# Altium schematic sheet [18] - POWER BLOCK DIAGRAM.SchDoc
size A3; DocumentNumber: 2; SheetNumber: 2; SheetTotal: 4
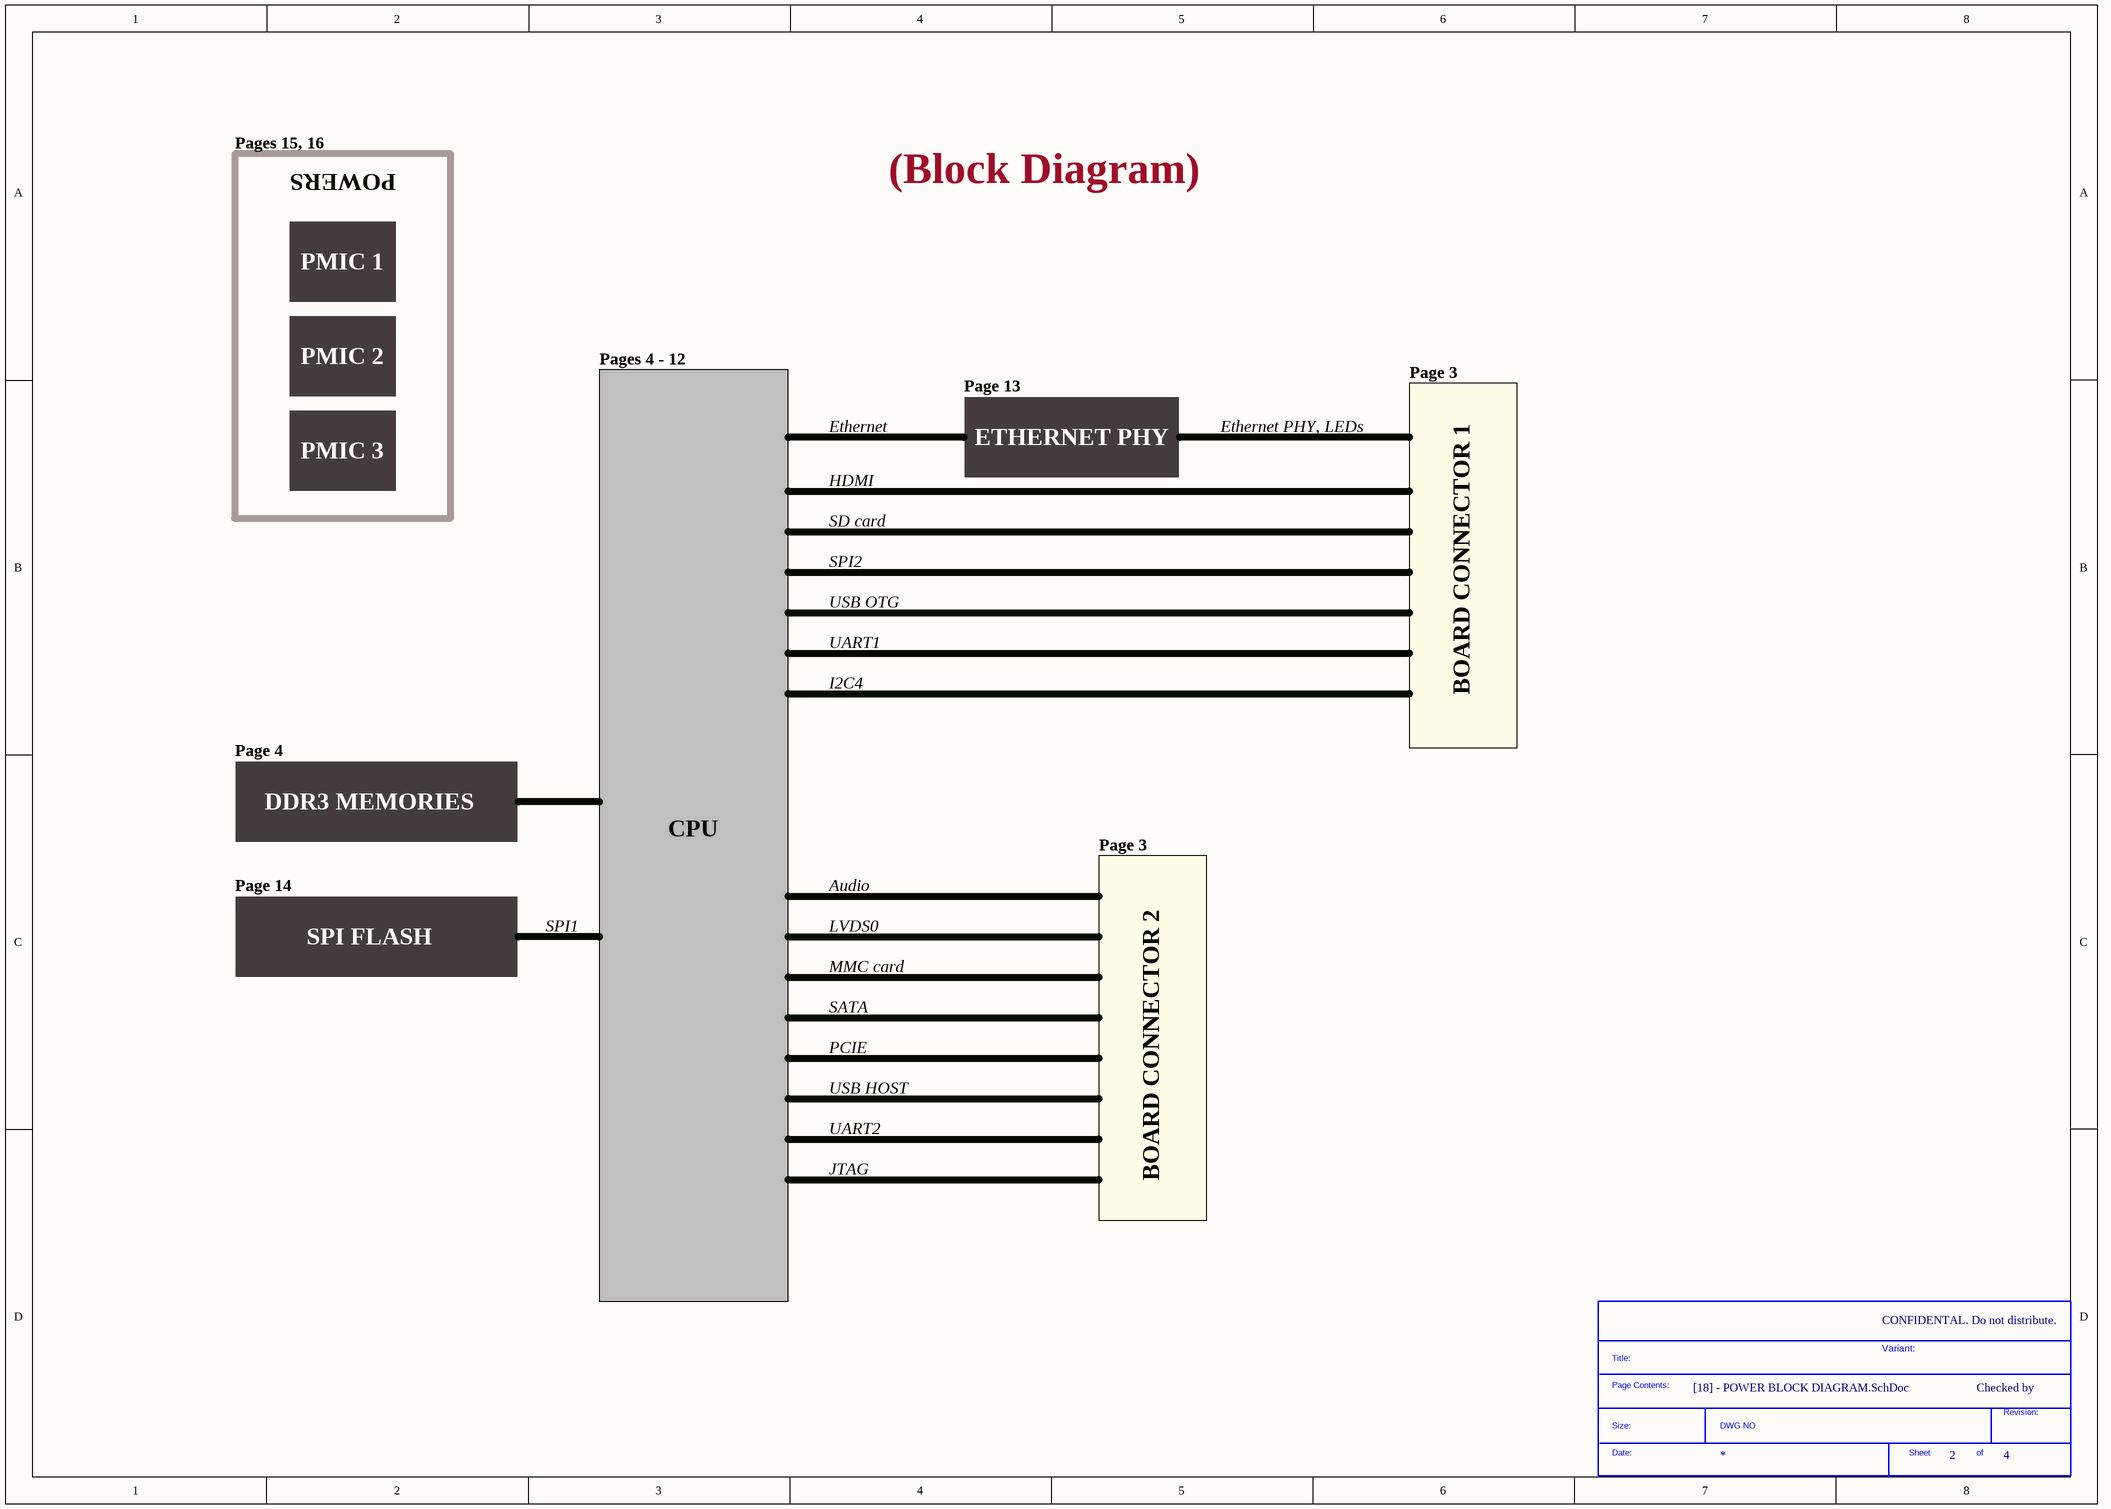
[diagram p0: [18] - POWER BLOCK DIAGRAM.SchDoc]

## Parts
*  SDTitleBlock  (value not drawn)  (graphical)

## Notes on the sheet
- Pages 15, 16
- POWERS
- (Block Diagram)
- PMIC 1
- PMIC 2
- Pages 4 - 12
- Page 3
- PMIC 3
- Ethernet
- Page 13
- ETHERNET PHY
- Ethernet PHY, LEDs
- HDMI
- SD card
- SPI2
- BOARD CONNECTOR 1
- USB OTG
- UART1
- I2C4
- Page 4
- DDR3 MEMORIES
- CPU
- Page 14
- Audio
- SPI FLASH
- SPI1
- LVDS0
- MMC card
- SATA
- PCIE
- BOARD CONNECTOR 2
- USB HOST
- UART2
- JTAG
- CONFIDENTAL. Do not distribute.
- Variant:
- Checked by
- (in symbol SDTitleBlock) Title:; Page Contents:; Revision:; Size:; DWG NO; Date:; Sheet; of